# Altium schematic sheet Main.SchDoc
size A4
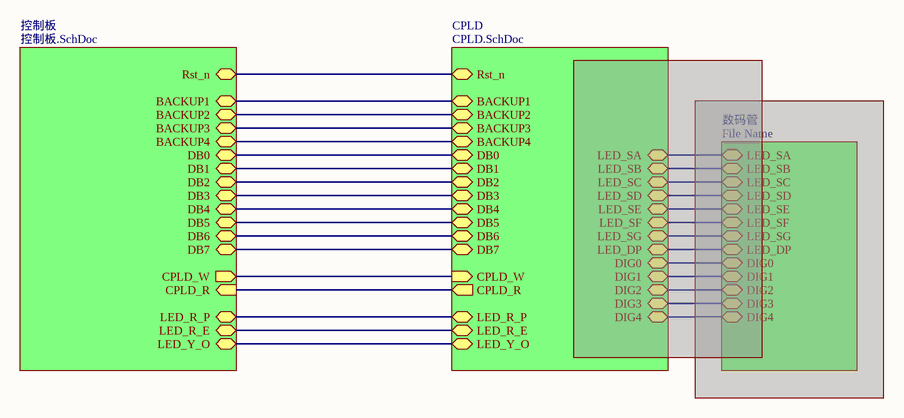
[diagram p0: Main.SchDoc]

## Sub-sheets
CPLD = CPLD.SchDoc: BACKUP1 (bidir), BACKUP2 (bidir), BACKUP3 (bidir), BACKUP4 (bidir), DB0 (bidir), DB1 (bidir), DB2 (bidir), DB3 (bidir), DB4 (bidir), DB5 (bidir), DB6 (bidir), DB7 (bidir), CPLD_W (in), CPLD_R (out), LED_SA (bidir), LED_SB (bidir), LED_SC (bidir), LED_SD (bidir), LED_SE (bidir), LED_SF (bidir), LED_SG (bidir), DIG0 (bidir), DIG1 (bidir), DIG2 (bidir), DIG3 (bidir), DIG4 (bidir), LED_DP (bidir), LED_R_P (bidir), LED_R_E (bidir), LED_Y_O (bidir), Rst_n (bidir)
控制板 = 控制板.SchDoc: BACKUP1 (bidir), BACKUP2 (bidir), BACKUP3 (bidir), BACKUP4 (bidir), DB0 (bidir), DB1 (bidir), DB2 (bidir), DB3 (bidir), DB4 (bidir), DB5 (bidir), DB6 (bidir), DB7 (bidir), CPLD_W (out), CPLD_R (in), LED_Y_O (bidir), LED_R_E (bidir), LED_R_P (bidir), Rst_n (bidir)
数码管 = File Name (masked out): LED_SA (bidir), LED_SB (bidir), LED_SC (bidir), LED_SD (bidir), LED_SE (bidir), LED_SF (bidir), LED_SG (bidir), DIG0 (bidir), DIG1 (bidir), DIG2 (bidir), DIG3 (bidir), DIG4 (bidir), LED_DP (bidir)

## Nets
(unnamed): sheet 控制板/BACKUP1, sheet CPLD/BACKUP1
(unnamed): sheet 控制板/BACKUP2, sheet CPLD/BACKUP2
(unnamed): sheet 控制板/BACKUP3, sheet CPLD/BACKUP3
(unnamed): sheet 控制板/BACKUP4, sheet CPLD/BACKUP4
(unnamed): sheet 控制板/DB0, sheet CPLD/DB0
(unnamed): sheet 控制板/DB1, sheet CPLD/DB1
(unnamed): sheet 控制板/DB2, sheet CPLD/DB2
(unnamed): sheet 控制板/DB3, sheet CPLD/DB3
(unnamed): sheet 控制板/DB4, sheet CPLD/DB4
(unnamed): sheet 控制板/DB5, sheet CPLD/DB5
(unnamed): sheet 控制板/DB6, sheet CPLD/DB6
(unnamed): sheet 控制板/DB7, sheet CPLD/DB7
(unnamed): sheet 控制板/CPLD_W, sheet CPLD/CPLD_W
(unnamed): sheet 控制板/CPLD_R, sheet CPLD/CPLD_R
(unnamed): sheet 控制板/LED_Y_O, sheet CPLD/LED_Y_O
(unnamed): sheet 控制板/LED_R_E, sheet CPLD/LED_R_E
(unnamed): sheet 控制板/LED_R_P, sheet CPLD/LED_R_P
(unnamed): sheet 控制板/Rst_n, sheet CPLD/Rst_n